# EAGLE design EskonzoUSB_switch (EAGLE 7.6.0)
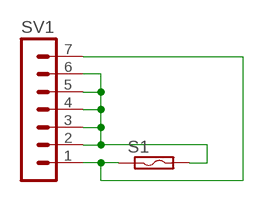
[diagram p0: schematic, sheet 1]

## Parts
S1  SMD030F  [SMD050F]
SV1  MA07-1  [MA07-1]

## Nets
GND: S1.2 SV1.2 SV1.3 SV1.4 SV1.5 SV1.6
N$1: S1.1 SV1.1 SV1.7

## Library data of the parts
S1 = switch-raychem:SMD*F: PolySwitch (TM) Resettable Device Source: Data sheet <http://www.farnell.com/datasheets/13482.pdf>
SV1 = con-lstb:MA07-1: PIN HEADER; OC_FARNELL: unknown; OC_NEWARK: unknown

## Board
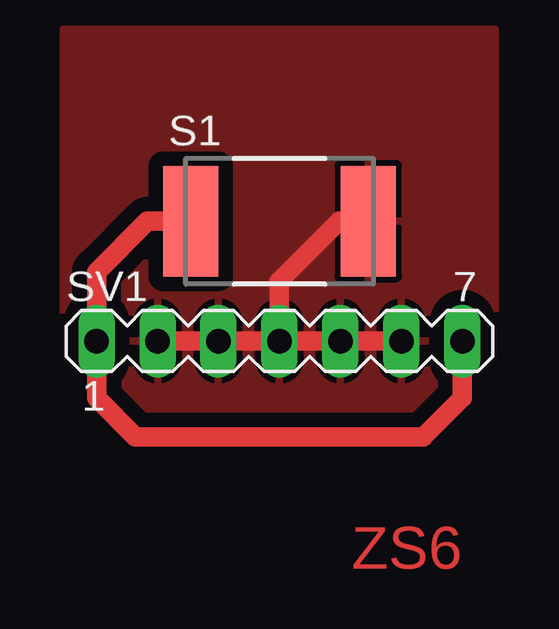
[diagram p1: board, top side]
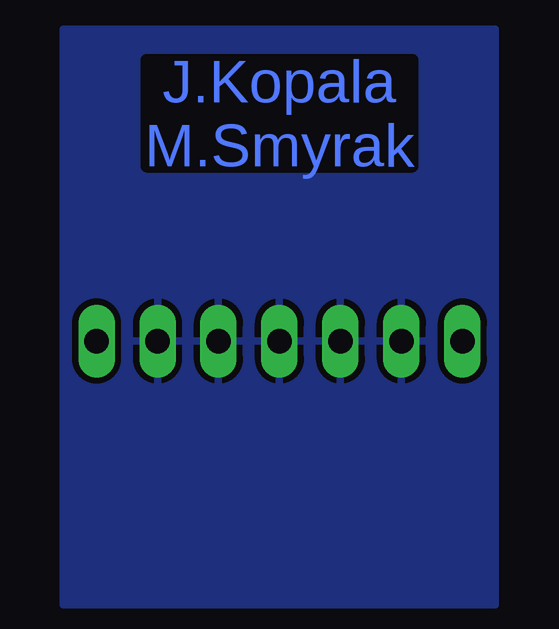
[diagram p2: board, bottom side, seen from below]

No outline drawn. Coordinates in mm, seen from the top.
Copper layers (1*16): Top 0.035mm / dielectric 1.5mm / Bottom 0.035mm
Design rules "default": minimum track width 10mil, minimum drill 24mil, track to track 8mil, track to pad 8mil, pad to pad 8mil, via to via 8mil, smd to smd 8mil, copper to edge 40mil, drill to drill 8mil, minimum pad ring 10mil, minimum via ring 8mil, stop-mask expansion 4mil, vias tented up to drill 0mil, thermal gap 10mil

### Footprints (pad centres in the part's own frame; a part is rotated, then mirrored left to right if it is on the bottom)
SMD050F = smd 2.3 x 4.6: 1 -3.7,0; 2 3.7,0
MA07-1 = drill 1.016 long: 1 -7.62,0; 2 -5.08,0; 3 -2.54,0; 4 0,0; 5 2.54,0; 6 5.08,0; 7 7.62,0

### Placement (x,y rotation side)
S1  9,16 0 top
SV1  9,11 0 top

### Tracks (layer width: path | path; a pad name or v marks a point on that pad's centre or on a via)
GND
  Top 0.813: SV1.2 SV1.3 8.5,11 | 8.5,11 SV1.4 SV1.5 SV1.6 | S1.2 11.5,16 9,13.5 9,11.5 8.5,11
  pour Top (isolate 0.61): 0,24 0,0 18,0 18,24
  pour Bottom (isolate 0.254): 0,0 18,0 18,24 0,24
N$1
  Top 0.813: S1.1 3.5,16 1.38,13.88 SV1.1 1.38,8.62 3,7 15,7 16.62,8.62 SV1.7

### Text on the board
Top: ZS6
Bottom: J.Kopala / M.Smyrak